# EAGLE design Drones Schematic Headers (EAGLE 8.6.3)
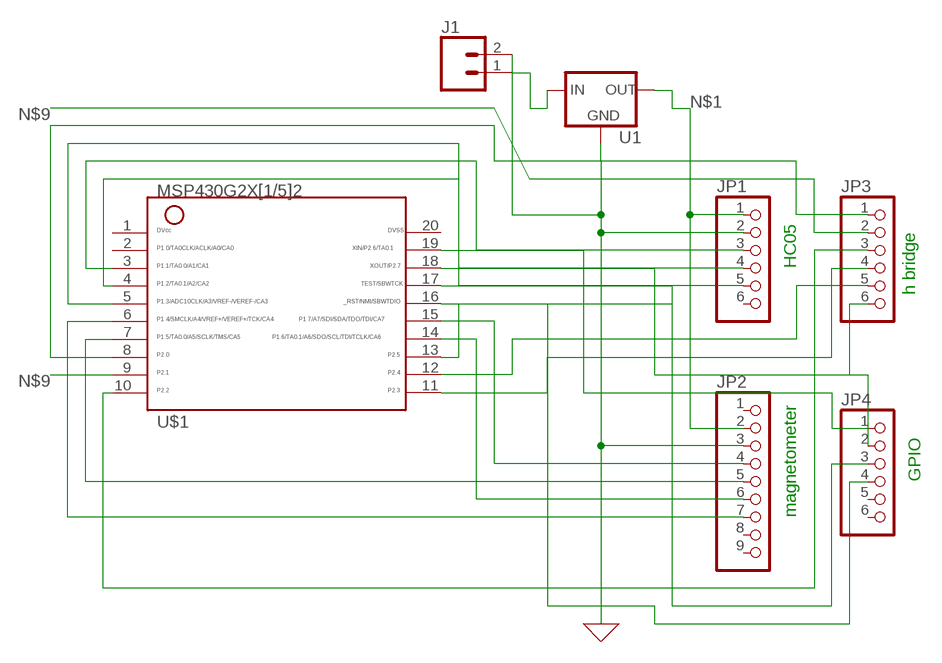
[diagram p0: schematic, sheet 1]

## Parts
J1  CONN_025MM  [SCREWTERMINAL-5MM-2]
JP1  PINHD-1X6  [1X06]
JP2  PINHD-1X9  [1X09-BIG]
JP3  PINHD-1X6  [1X06]
JP4  PINHD-1X6  [1X06]
U1  V_REG_78XXSINK  [TO220-IGO]
U$1  G2X[1/5]2---N20  [N20]

## Nets
GND: J1.2 JP1.2 JP2.3 U1.GND
N$1: JP1.1 JP2.2 U1.OUT
N$2: JP2.4 U$1.15
N$3: JP2.5 U$1.7
N$4: JP2.6 U$1.14
N$5: JP2.7 U$1.6
N$6: JP1.3 U$1.3
N$7: JP1.4 U$1.4
N$8: JP3.1 U$1.8
N$9: JP3.2 U$1.9
N$10: JP3.3 U$1.10
N$11: JP3.4 U$1.11
N$12: JP3.5 U$1.12
N$13: JP3.6 U$1.13
N$14: J1.1 U1.IN
N$15: JP1.5 U$1.5
N$16: JP4.1 U$1.19
N$17: JP4.2 U$1.18
N$18: JP4.3 U$1.17
N$19: JP4.4 U$1.16
Unconnected: JP1.6 JP2.1 JP2.8 JP2.9 JP4.5 JP4.6 U$1.1 U$1.2 U$1.20

## Notes on the sheet
- h bridge
- HC05
- GPIO
- magnetometer

## Library data of the parts
J1 = SparkFun-Connectors:CONN_02: Multi connection point. Often used as Generic Header-pin footprint for 0.1 inch spaced/style header connections On any of the 0.1 inch spaced packages, you can populate with these: Break Away Headers - Straight <https://www.sparkfun.com/products/116> (PRT-00116) Break Away Male Headers - Right Angle <https://www.sparkfun.com/products/553> (PRT-00553) Female Headers <https://www.sparkfun.com/products/115> (PRT-00115) Break Away Headers - Machine Pin <https://www.sparkfun.com/products/117> (PRT-00117) Break Away Female Headers - Swiss Machine Pin <https://www.sparkfun.com/products/743> (PRT-00743) For SCREWTERMINALS and SPRING TERMINALS visit here: Screw Terimnals on SparkFun.com <https://www.sparkfun.com/search/results?term=Screw+Terminals> (5mm/3.5mm/2.54mm spacing) This device is also useful as a general connection point to wire up your design to another part of your project. Our various solder wires solder well into these plated through hole pads. Hook-Up Wire - Assortment (Stranded, 22 AWG) <https://www.sparkfun.com/products/11375> (PRT-11375) Hook-Up Wire - Assortment (Solid Core, 22 AWG) <https://www.sparkfun.com/products/11367> (PRT-11367) View the entire wire category on our website here <https://www.sparkfun.com/categories/141> Special notes: Molex polarized connector foot print use with: PRT-08233 with associated crimp pins and housings. 2.54_SCREWTERM for use with PRT-10571. 3.5mm Screw Terminal footprints for PRT-08084 5mm Screw Terminal footprints for use with PRT-08432; SF_SKU: PRT-08432
JP1 JP3 JP4 = adafruit:PINHD-1X6: PIN HEADER
JP2 = adafruit:PINHD-1X9: Pin header 1x10 0.1" spacing With round pins
U1 = SparkFun-IC-Power:V_REG_78XX: Voltage Regulator Standard 78xx regulator. IGO (Input Ground Output). Spark Fun Electronics SKU : COM-00107
U$1 = TI_MSP430_v16:G2X[1/5]2---N20: MSP430G2X[1/5]2 MSP430G2x52, MSP430G2x12 PDIP (N) 20 Pin Package http://focus.ti.com/docs/prod/folders/print/msp430g2452.html

## Board
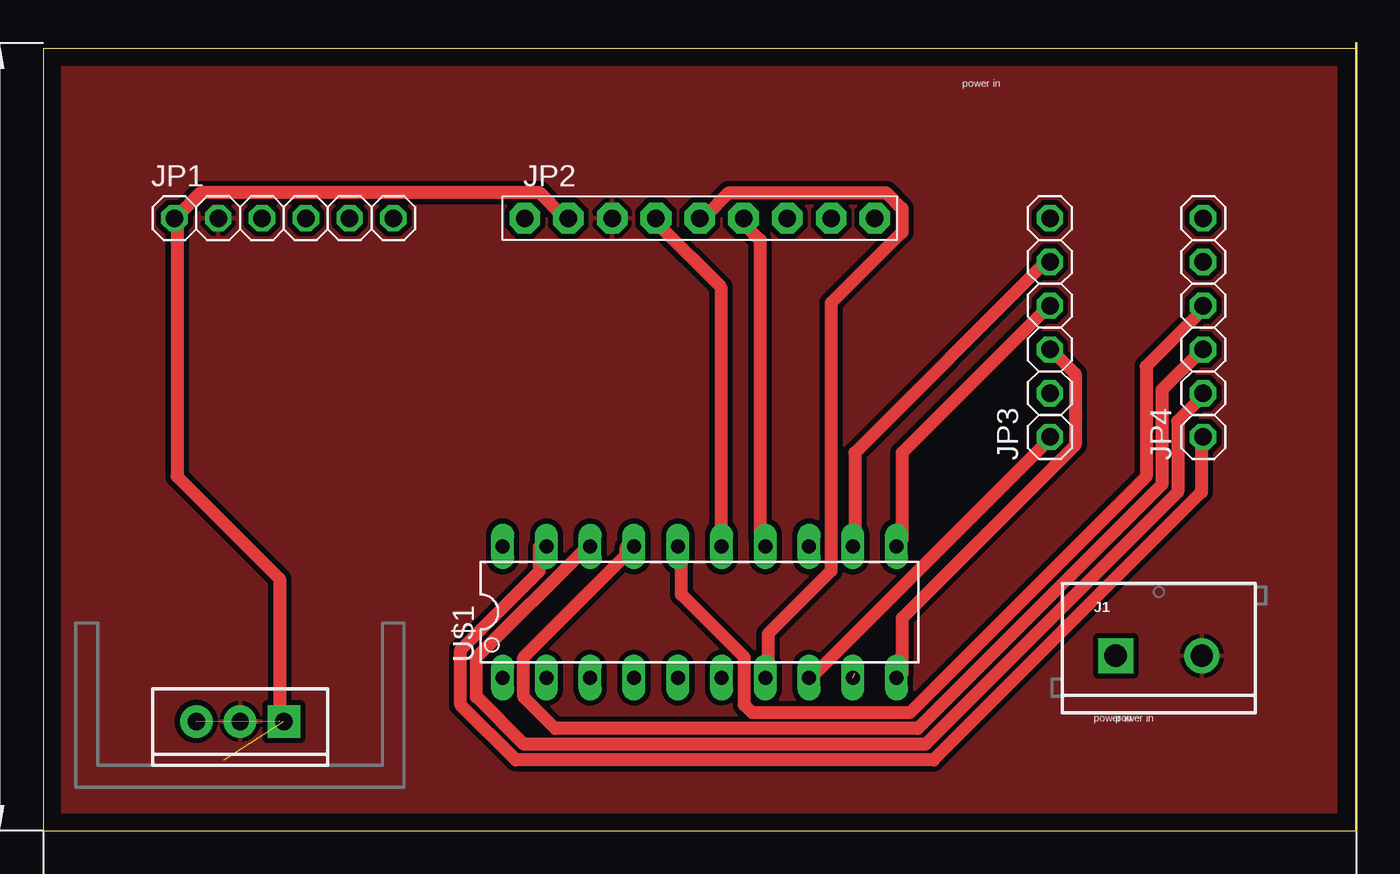
[diagram p1: board, top side]
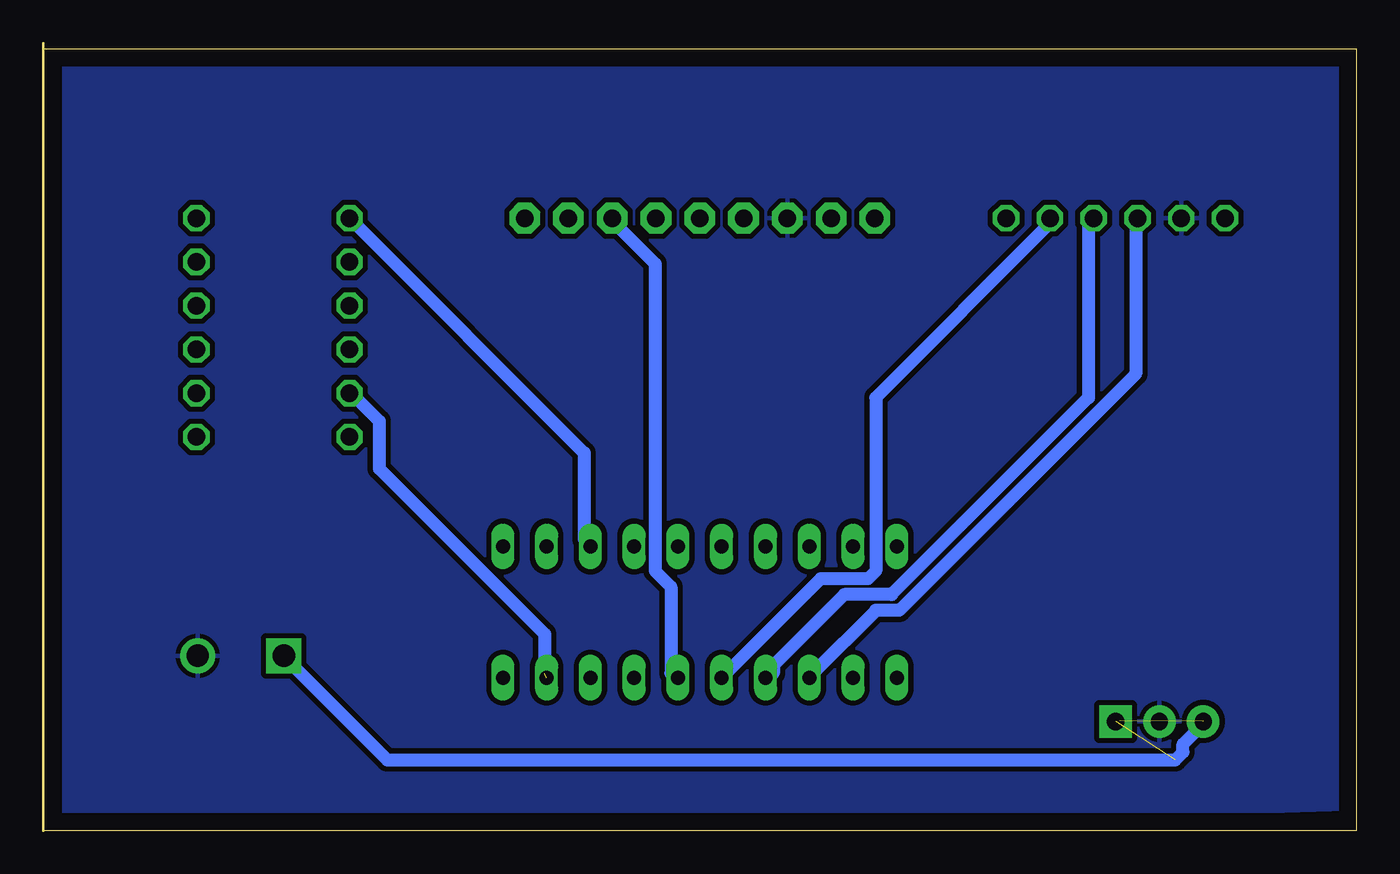
[diagram p2: board, bottom side, seen from below]

Size 76.2 x 45.72 mm. Coordinates in mm from the lower left corner, seen from the top.
Outline: 76.18,0 0,0 0,45.39 76.18,45.39
Outline: 76.2,45.72 76.2,0
Copper layers (1*16): Top 0.035mm / dielectric 1.5mm / Bottom 0.035mm
Design rules "default *": minimum track width 30mil, minimum drill 0.35mm, track to track 6mil, track to pad 6mil, pad to pad 6mil, via to via 6mil, smd to smd 6mil, copper to edge 40mil, drill to drill 6mil, minimum pad ring 10mil, minimum via ring 8mil, stop-mask expansion 4mil, vias tented up to drill 0mil, thermal gap 10mil

### Footprints (pad centres in the part's own frame; a part is rotated, then mirrored left to right if it is on the bottom)
SCREWTERMINAL-5MM-2 = drill 1.3 pad 2.032 square: 1 0,0 | drill 1.3 pad 2.032: 2 5,0
1X06 = drill 1.016 octagon: 1 -6.35,0; 2 -3.81,0; 3 -1.27,0; 4 1.27,0; 5 3.81,0; 6 6.35,0
1X09-BIG = drill 1.016 pad 1.778 octagon: 1 -10.16,0; 2 -7.62,0; 3 -5.08,0; 4 -2.54,0; 5 0,0; 6 2.54,0; 7 5.08,0; 8 7.62,0; 9 10.16,0
TO220-IGO = drill 1 pad 1.88: GND 0,0; OUT 2.54,0 | drill 1 pad 1.88 square: IN -2.54,0
N20 = drill 0.813 long: 1 -11.435,-3.81; 2 -8.895,-3.81; 3 -6.355,-3.81; 4 -3.815,-3.81; 5 -1.275,-3.81; 6 1.265,-3.81; 7 3.805,-3.81; 8 6.345,-3.81; 9 8.885,-3.81; 10 11.425,-3.81; 11 11.425,3.81; 12 8.885,3.81; 13 6.345,3.81; 14 3.805,3.81; 15 1.265,3.81; 16 -1.275,3.81; 17 -3.815,3.81; 18 -6.355,3.81; 19 -8.895,3.81; 20 -11.435,3.81

### Placement (x,y rotation side)
J1  62.23,10.16 0 top
JP1  13.97,35.56 0 top
JP2  38.1,35.56 0 top
JP3  58.42,29.21 90 top
JP4  67.31,29.21 90 top
U1  11.43,6.35 180 top
U$1  38.1,12.7 0 top

### Tracks (layer width: path | path; a pad name or v marks a point on that pad's centre or on a via)
GND
  pour Top (isolate 0.305): 0,45.72 76.2,45.72 76.2,0 0,0
  pour Bottom (isolate 0.305): -1.27,46.99 74.93,46.99 78.74,-1.27 -1.27,1.27
N$1  (1 unrouted)
  Top 0.762: JP2.2 30.18,35.66 28.8,37.03 9.14,37.03 7.77,35.66 JP1.1 7.77,35.2 7.77,20.57 13.72,14.63 13.72,6.4
N$2
  Top 0.762: U$1.15 39.32,16.92 39.32,31.55 35.66,35.2 JP2.4
N$3
  Top 0.762: U$1.7 42.06,9.14 42.06,11.43 45.72,15.09 45.72,30.63 49.84,34.75 49.84,36.12 48.92,37.03 39.78,37.03 38.41,35.66 JP2.5
N$4
  Top 0.762: U$1.14 41.6,16.92 41.6,34.29 40.69,35.2 JP2.6
N$5
  Bottom 0.762: U$1.6 39.78,9.14 39.78,14.17 40.69,15.09 40.69,32.92 42.98,35.2 JP2.7
N$6
  Bottom 0.762: U$1.3 31.55,9.14 27.89,12.8 26.52,12.8 12.8,26.52 12.8,35.2 JP1.3
N$7
  Bottom 0.762: U$1.4 33.83,9.14 33.83,9.6 29.72,13.72 26.98,13.72 15.54,25.15 15.54,35.2 JP1.4
N$8
  Top 0.762: U$1.8 44.81,9.14 58.52,22.86 JP3.1
N$9  (1 unrouted)
  Bottom 0.762: 47.09,9.14 47.09,11.43 56.69,21.03 56.69,23.77 58.06,25.15 JP3.2
N$10
  Top 0.762: U$1.10 49.84,9.14 49.84,12.34 59.89,22.4 59.89,26.52 58.52,27.89 JP3.3
N$11
  Top 0.762: U$1.11 49.84,16.92 49.84,21.95 58.06,30.18 JP3.4
N$12
  Top 0.762: U$1.12 47.09,16.92 47.09,21.95 58.06,32.92 JP3.5
N$13
  Bottom 0.762: JP3.6 44.81,21.95 44.81,16.92 U$1.13
N$14  (1 unrouted)
  Bottom 0.762: 9.14,5.94 10.06,5.03 10.06,4.57 10.52,4.12 56.24,4.12 62.18,10.06 J1.1
N$15
  Bottom 0.762: U$1.5 36.58,9.14 31.09,14.63 28.35,14.63 27.89,15.09 27.89,25.15 17.83,35.2 JP1.5
N$16
  Top 0.762: U$1.19 28.8,16.46 28.8,15.09 24.23,10.52 24.23,7.32 27.43,4.12 51.66,4.12 67.21,19.66 67.21,22.86 JP4.1
N$17
  Top 0.762: U$1.18 31.55,16.46 25.15,10.06 25.15,7.77 27.89,5.03 51.21,5.03 65.84,19.66 65.84,23.77 67.21,25.15 JP4.2
N$18
  Top 0.762: U$1.17 33.83,16.46 33.83,16 27.89,10.06 27.89,7.77 29.72,5.94 50.75,5.94 64.92,20.12 64.92,25.6 67.21,27.89 JP4.3
N$19
  Top 0.762: U$1.16 37.03,16.46 37.03,13.72 40.69,10.06 40.69,7.32 41.15,6.86 50.29,6.86 64.01,20.57 64.01,26.98 67.21,30.18 JP4.4

### Text on the board
tPlace: power in | power in | power in